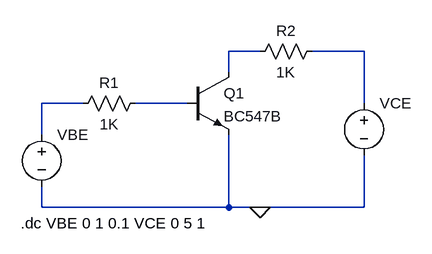
[diagram p0: schematic 10234.asc]
10234.asc, the LTspice schematic file:
Version 4
SHEET 1 880 680
WIRE 272 16 224 16
WIRE 432 16 352 16
WIRE 224 48 224 16
WIRE 0 96 -64 96
WIRE 160 96 80 96
WIRE 432 96 432 16
WIRE -64 144 -64 96
WIRE -64 256 -64 224
WIRE 224 256 224 144
WIRE 224 256 -64 256
WIRE 272 256 224 256
WIRE 432 256 432 176
WIRE 432 256 272 256
FLAG 272 256 0
SYMBOL npn 160 48 R0
SYMATTR InstName Q1
SYMATTR Value BC547B
SYMBOL voltage 432 80 R0
WINDOW 123 0 0 Left 0
WINDOW 39 0 0 Left 0
SYMATTR InstName VCE
SYMATTR Value ""
SYMBOL res 96 80 R90
WINDOW 0 0 56 VBottom 2
WINDOW 3 32 56 VTop 2
SYMATTR InstName R1
SYMATTR Value 1K
SYMBOL res 368 0 R90
WINDOW 0 0 56 VBottom 2
WINDOW 3 32 56 VTop 2
SYMATTR InstName R2
SYMATTR Value 1K
SYMBOL voltage -64 128 R0
WINDOW 123 0 0 Left 0
WINDOW 39 0 0 Left 0
SYMATTR InstName VBE
SYMATTR Value ""
TEXT -96 280 Left 2 !.dc VBE 0 1 0.1 VCE 0 5 1

The netlist it stands for:
* 10234.asc
Q1 N001 N004 0 0 BC547B
VCE N002 0
R1 N004 N003 1K
R2 N002 N001 1K
VBE N003 0
.model NPN NPN
.model PNP PNP
.lib standard.bjt
.dc VBE 0 1 0.1 VCE 0 5 1
.backanno
.end